# Altium schematic sheet Simple PZ.SchDoc
size A4; Organization: Altium Limited; Address1: L3, 12a Rodborough Rd; Address2: Frenchs Forest; Address3: NSW; Address4: Australia 2086; DocumentNumber: 1; SheetNumber: 1; SheetTotal: 1
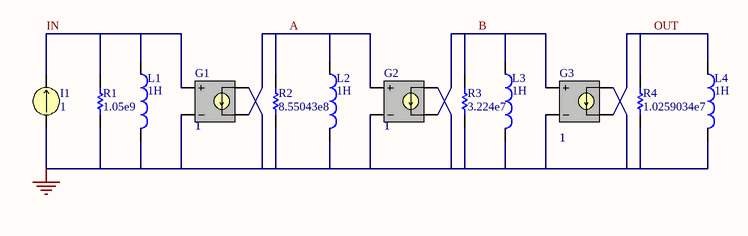
[diagram p0: Simple PZ.SchDoc]

## Parts
G1  Gain: 1  (hidden comment: GSRC)
G2  Gain: 1  (hidden comment: GSRC)
G3  Gain: 1  (hidden comment: GSRC)
I1  1
L1  value 1H  [C1005-0402]  (hidden comment: Inductor)
L2  1H  [C1005-0402]
L3  1H  [C1005-0402]
L4  1H  [C1005-0402]
R1  1.05e9  [AXIAL-0.3]
R2  8.55043e8  [AXIAL-0.3]
R3  3.224e7  [AXIAL-0.3]
R4  1.0259034e7  [AXIAL-0.3]

## Nets
GND: G1.2(NC-) G1.3(N+) G2.2(NC-) G2.3(N+) G3.2(NC-) G3.3(N+) I1.1 L1.2 L2.2 L3.2 L4.2 R1.2 R2.2 R3.2 R4.2
A: G1.4(N-) G2.1(NC+) L2.1 R2.1
B: G2.4(N-) G3.1(NC+) L3.1 R3.1
IN: G1.1(NC+) I1.2 L1.1 R1.1
OUT: G3.4(N-) L4.1 R4.1

## Notes on the sheet
- Title
- Size:
- Date:
- A4
- Number:
- Time:
- Revision:
- Sheet
- of
- File:

## Library data of the parts
G1-G3 = GSRC: Voltage Controlled Current Source; Manufacturer: Generic Components; Class I: Simulation; Note: PCB Footprint - Not required; Published: 8-Jun-2000; Revision: 17-Jul-2002: Re-released for DXP Platform.; Package Reference: Not Applicable; Publisher: Altium Limited; Class II: Current Source
I1 = ISRC: Current Source; Manufacturer: Generic Components; Class I: Simulation; Note: PCB Footprint - Not required; Published: 8-Jun-2000; Revision: 17-Jul-2002: Re-released for DXP Platform.; Package Reference: Not Applicable; Publisher: Altium Limited; Class II: Current Source; AC Magnitude: 1; Value: 1
L1-L4 = Inductor: Manufacturer: Generic Components; Class I: Passive; Published: 8-Jun-2000; Revision: July-2002: Re-released for DXP Platform.; Publisher: Altium Limited; Class II: Inductor
  L2-L4: Value: 1H
R1-R4 = Res1: Resistor; Manufacturer: Generic Components; Class I: Passive; Published: 8-Jun-2000; Revision: July-2002: Re-released for DXP Platform.; Publisher: Altium Limited; Class II: Resistor
  R1: Value: 1.05e9
  R2: Value: 8.55043e8
  R3: Value: 3.224e7
  R4: Value: 1.0259034e7